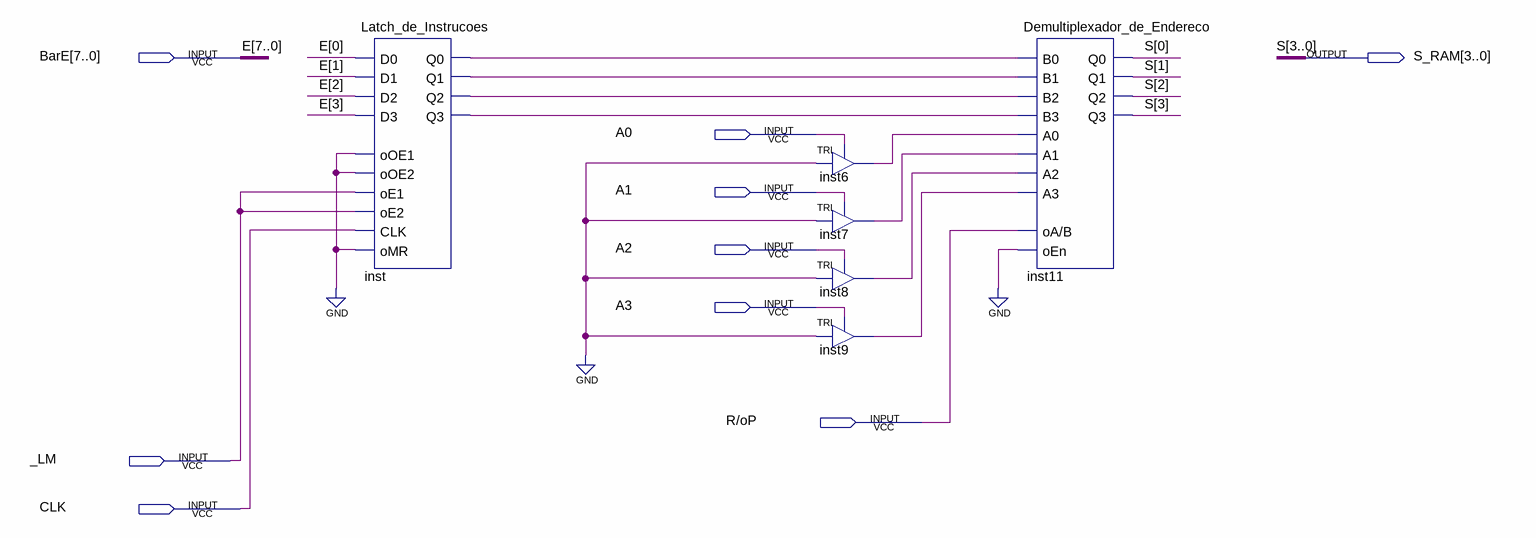
[diagram p0: schematic sheet]
// Quartus schematic REM.bdf as structural Verilog: 6 symbols, 9 pins
module REM (
  input  [7:0] BarE,
  input  A0,
  input  A1,
  input  A2,
  input  A3,
  input  \R/oP ,
  input  _LM,
  input  CLK,
  output [3:0] S_RAM
);

  wire inst6_out, inst7_out, inst8_out, inst9_out, inst_q0, inst_q1, inst_q2, inst_q3;

  Latch_de_Instrucoes inst (
    .D0(BarE[0]), .D1(BarE[1]), .D2(BarE[2]), .D3(BarE[3]), .oOE1(1'b0), .oOE2(1'b0), .oE1(_LM), .oE2(_LM),
    .CLK(CLK), .oMR(1'b0), .Q0(inst_q0), .Q1(inst_q1), .Q2(inst_q2), .Q3(inst_q3));
  TRI inst6 (.IN(1'b0), .OE(A0), .OUT(inst6_out));
  TRI inst7 (.IN(1'b0), .OE(A1), .OUT(inst7_out));
  TRI inst8 (.IN(1'b0), .OE(A2), .OUT(inst8_out));
  TRI inst9 (.IN(1'b0), .OE(A3), .OUT(inst9_out));
  Demultiplexador_de_Endereco inst11 (
    .B0(inst_q0), .B1(inst_q1), .B2(inst_q2), .B3(inst_q3), .A0(inst6_out), .A1(inst7_out), .A2(inst8_out),
    .A3(inst9_out), .\oA/B (\R/oP ), .oEn(1'b0), .Q0(S_RAM[0]), .Q1(S_RAM[1]), .Q2(S_RAM[2]), .Q3(S_RAM[3]));

  // Other names for the same wires on the sheet: E[7:0] = BarE; S[3:0] = S_RAM
endmodule
